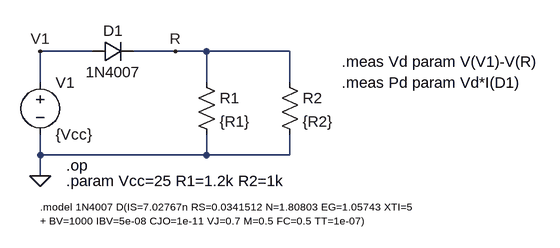
[diagram p0: schematic LAB01aBak.asc]
LAB01aBak.asc, the LTspice schematic file:
Version 4
SHEET 1 1372 680
WIRE 128 0 48 0
WIRE 256 0 192 0
WIRE 304 0 256 0
WIRE 432 0 304 0
WIRE 48 48 48 0
WIRE 304 48 304 0
WIRE 432 48 432 0
WIRE 48 160 48 128
WIRE 304 160 304 128
WIRE 304 160 48 160
WIRE 432 160 432 128
WIRE 432 160 304 160
WIRE 48 192 48 160
FLAG 48 192 0
FLAG 256 0 R
FLAG 48 0 V1
SYMBOL voltage 48 32 R0
WINDOW 123 0 0 Left 0
WINDOW 39 0 0 Left 0
SYMATTR InstName V1
SYMATTR Value {Vcc}
SYMBOL diode 128 16 R270
WINDOW 0 32 32 VTop 2
WINDOW 3 0 32 VBottom 2
SYMATTR InstName D1
SYMATTR Value 1N4007
SYMBOL res 288 32 R0
SYMATTR InstName R1
SYMATTR Value {R1}
SYMBOL res 416 32 R0
SYMATTR InstName R2
SYMATTR Value {R2}
TEXT 88 176 Left 2 !.op
TEXT 88 200 Left 2 !.param Vcc=25 R1=1.2k R2=1k
TEXT 48 240 Left 1 !.model 1N4007 D(IS=7.02767n RS=0.0341512 N=1.80803 EG=1.05743 XTI=5 \n+ BV=1000 IBV=5e-08 CJO=1e-11 VJ=0.7 M=0.5 FC=0.5 TT=1e-07)
TEXT 512 16 Left 2 !.meas Vd param V(V1)-V(R)
TEXT 512 48 Left 2 !.meas Pd param Vd*I(D1)

The netlist it stands for:
* LAB01aBak.asc
V1 V1 0 {Vcc}
D1 V1 R 1N4007
R1 R 0 {R1}
R2 R 0 {R2}
.model D D
.lib standard.dio
.op
.param Vcc=25 R1=1.2k R2=1k
.model 1N4007 D(IS=7.02767n RS=0.0341512 N=1.80803 EG=1.05743 XTI=5
+ BV=1000 IBV=5e-08 CJO=1e-11 VJ=0.7 M=0.5 FC=0.5 TT=1e-07)
.meas Vd param V(V1)-V(R)
.meas Pd param Vd*I(D1)
.backanno
.end